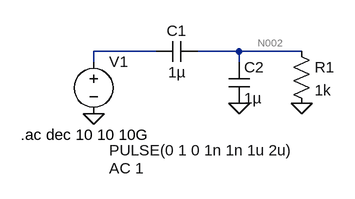
[diagram p0: schematic Draft5.asc]
Draft5.asc, the LTspice schematic file:
Version 4
SHEET 1 880 680
WIRE 80 64 -16 64
WIRE 208 64 144 64
WIRE 304 64 208 64
WIRE -16 80 -16 64
WIRE 208 80 208 64
FLAG 304 144 0
FLAG -16 160 0
FLAG 208 144 0
SYMBOL cap 144 48 R90
WINDOW 0 0 32 VBottom 2
WINDOW 3 32 32 VTop 2
SYMATTR InstName C1
SYMATTR Value 1µ
SYMBOL res 288 48 R0
SYMATTR InstName R1
SYMATTR Value 1k
SYMBOL voltage -16 64 R0
WINDOW 3 24 152 Left 2
WINDOW 123 24 180 Left 2
WINDOW 39 0 0 Left 0
SYMATTR Value PULSE(0 1 0 1n 1n 1u 2u)
SYMATTR Value2 AC 1
SYMATTR InstName V1
SYMBOL cap 192 80 R0
SYMATTR InstName C2
SYMATTR Value 1µ
TEXT -128 192 Left 2 !.ac dec 10 10 10G

The netlist it stands for:
* Draft5.asc
C1 N002 N001 1µ
R1 N002 0 1k
V1 N001 0 PULSE(0 1 0 1n 1n 1u 2u) AC 1
C2 N002 0 1µ
.ac dec 10 10 10G
.backanno
.end

* Results of the author's LTspice run, read from the files saved beside the schematic
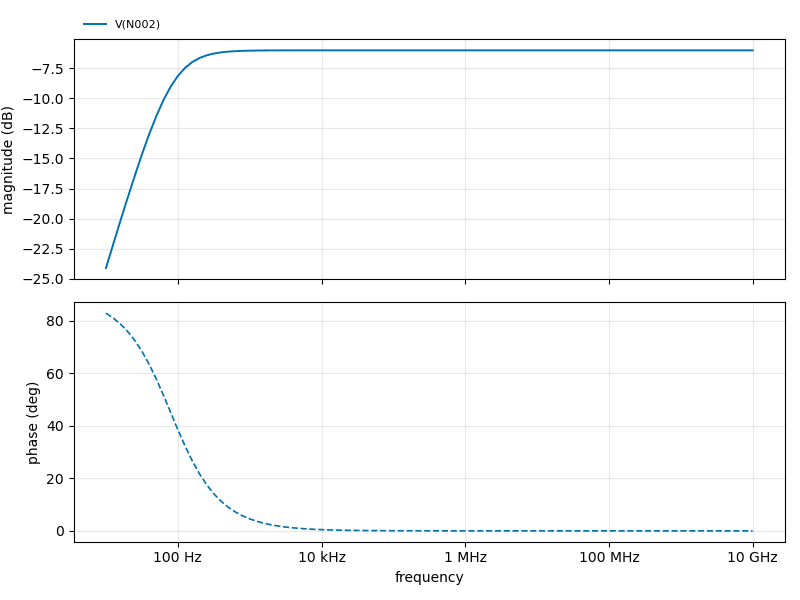
[diagram p1: AC Analysis of Draft5.asc, plotted from the saved traces]
* AC Analysis, 1 run:
*   V(N002): -24.10 dB at 10 Hz, -6.02 dB at 10 GHz, peak -6.02 dB at 6.31 GHz, 3 dB below the peak at 79.6 Hz